# Altium schematic sheet 1.power.SchDoc: Power Schematic
size A; DrawnBy: Pramod Sandaruwan; DocumentNumber: 1; Revision: V3; SheetNumber: 1; SheetTotal: 6
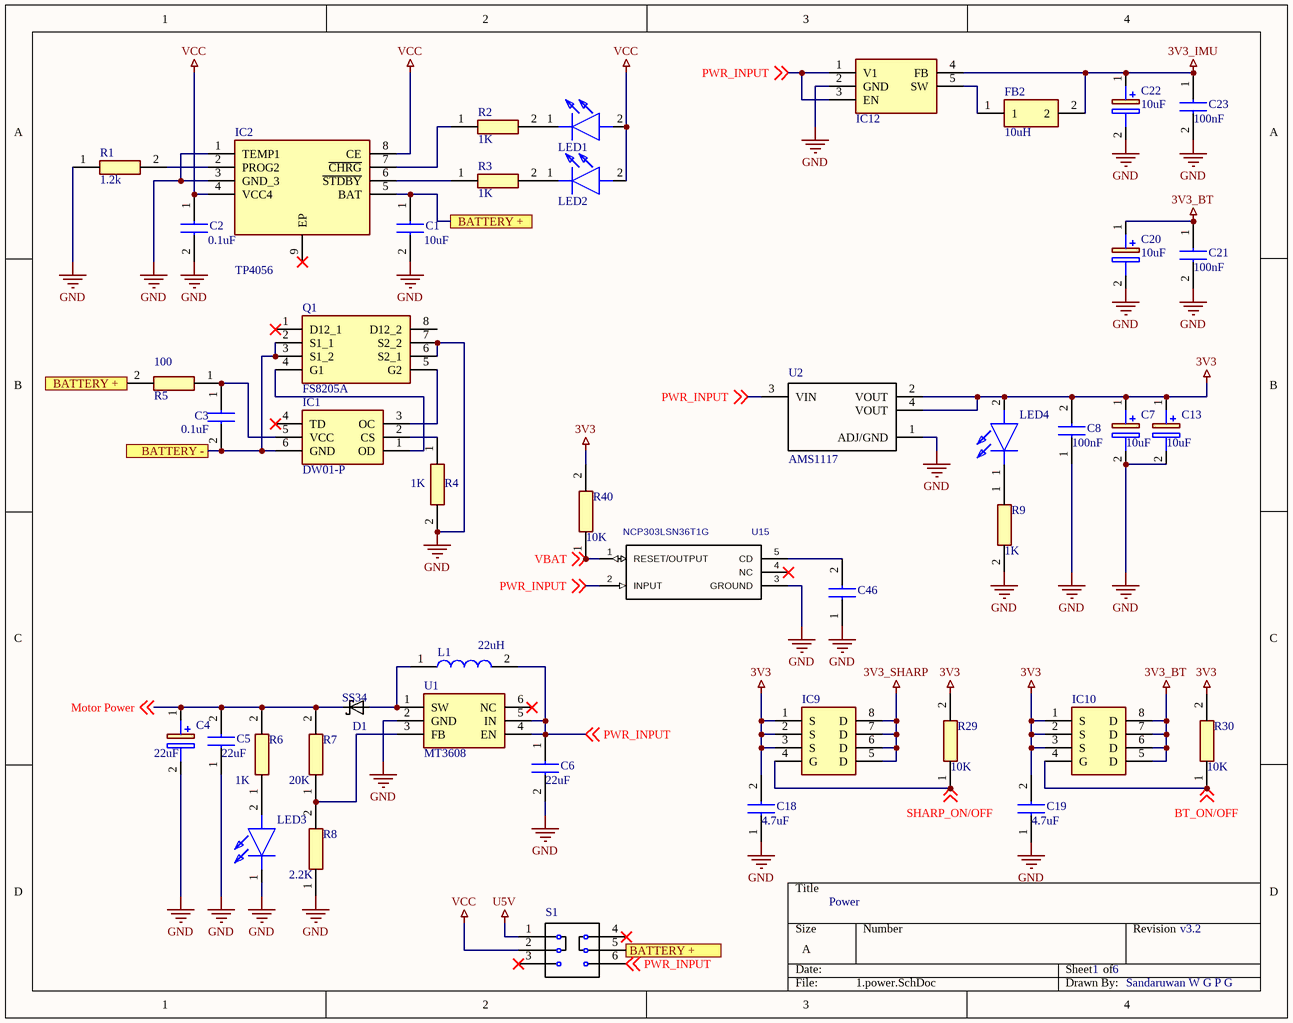
[diagram p0: 1.power.SchDoc]

## Parts
C1  value 10uF  [CAPC2012X94N]  (hidden comment: 08055A101JAT2A)
C2  value 0.1uF  [CAPC2012X94N]  (hidden comment: 08055A101JAT2A)
C3  value 0.1uF  [CAPC2012X94N]  (hidden comment: 08055A101JAT2A)
C4  value 22uF  [CAPAE830X1050N]  (hidden comment: UUD1E221MNL1GS)
C5  value 22uF  [CAPC2012X94N]  (hidden comment: 08055A101JAT2A)
C6  value 22uF  [CAPC2012X94N]  (hidden comment: 08055A101JAT2A)
C7  value 10uF  [CAPPM3216X180N]  (hidden comment: tantalum capacitor 1206)
C8  value 100nF  [CAPC2012X94N]  (hidden comment: 08055A101JAT2A)
C13  value 10uF  [CAPPM3216X180N]  (hidden comment: tantalum capacitor 1206)
C18  value 4.7uF  [CAPC2012X94N]  (hidden comment: 08055A101JAT2A)
C19  value 4.7uF  [CAPC2012X94N]  (hidden comment: 08055A101JAT2A)
C20  value 10uF  [CAPPM3216X180N]  (hidden comment: tantalum capacitor 1206)
C21  value 100nF  [CAPC2012X94N]  (hidden comment: 08055A101JAT2A)
C22  value 10uF  [CAPPM3216X180N]  (hidden comment: tantalum capacitor 1206)
C23  value 100nF  [CAPC2012X94N]  (hidden comment: 08055A101JAT2A)
C46  08055A101JAT2A  [CAPC2012X94N]  (value not drawn)
D1  SS34  [*SMA]
FB2  value 10uH  [BEADC1608X95N]  (hidden comment: inductor 0603)
IC1  DW01-P  [SOT95P280X135-6N]
IC2  TP4056  [SOIC127P600X175-9N]
IC9  SI4143DY-T1-GE3  [SI4143DY-T1-GE3]  (value not drawn)
IC10  SI4143DY-T1-GE3  [SI4143DY-T1-GE3]  (value not drawn)
IC12  TPS62203  [SOT95P280X145-5N]  (value not drawn)
L1  value 22uH  [INDPM8080X420N]  (hidden comment: 74404084220)
LED1  150080BS75000  [LEDC2012X80N]  (value not drawn)
LED2  150080BS75000  [LEDC2012X80N]  (value not drawn)
LED3  150080BS75000  [LEDC2012X80N]  (value not drawn)
LED4  150080BS75000  [LEDC2012X80N]  (value not drawn)
Q1  FS8205A  [SOP65P640X120-8N]
R1  value 1.2k  [RESC2012X65N]  (hidden comment: CPF0805B100KE)
R2  value 1K  [RESC2012X65N]  (hidden comment: CPF0805B100KE)
R3  value 1K  [RESC2012X65N]  (hidden comment: CPF0805B100KE)
R4  value 1K  [RESC2012X65N]  (hidden comment: CPF0805B100KE)
R5  value 100  [RESC2012X65N]  (hidden comment: CPF0805B100KE)
R6  value 1K  [RESC2012X65N]  (hidden comment: CPF0805B100KE)
R7  value 20K  [RESC2012X65N]  (hidden comment: CPF0805B100KE)
R8  value 2.2K  [RESC2012X65N]  (hidden comment: CPF0805B100KE)
R9  value 1K  [RESC2012X65N]  (hidden comment: CPF0805B100KE)
R29  value 10K  [RESC2012X65N]  (hidden comment: CPF0805)
R30  value 10K  [RESC2012X65N]  (hidden comment: CPF0805)
R40  value 10K  [RESC2012X65N]  (hidden comment: CPF0805)
S1  1-1437575-7  [*SW_1-1437575-7]  (value not drawn)
U1  MT3608  [SOT95P280X145-6N]
U2  AMS1117  [*SOT229P700X180-4N]
U15  NCP303LSN36T1G  [TSOP-5]

## Ports
BATTERY +, BATTERY -

## Nets
3V3: C7.1(+) C8.2 C13.1(+) C18.2 C19.2 IC9.1(S) IC9.2(S) IC9.3(S) IC10.1(S) IC10.2(S) IC10.3(S) LED4.2(A) R29.2 R30.2 R40.2 U2.2(VOUT) U2.4(VOUT)
3V3_BT: C20.1(+) C21.1 IC10.5(D) IC10.6(D) IC10.7(D) IC10.8(D)
3V3_IMU: C22.1(+) C23.1 FB2.2 IC12.4(FB)
3V3_SHARP: IC9.5(D) IC9.6(D) IC9.7(D) IC9.8(D)
GND: C1.2 C2.2 C4.2(-) C5.1 C6.2 C7.2(-) C8.1 C13.2(-) C18.1 C19.1 C20.2(-) C21.2 C22.2(-) C23.2 C46.1 IC2.1(TEMP1) IC2.3(GND_3) IC12.2(GND) LED3.1(K) Q1.6(S2_1) Q1.7(S2_2) R1.1 R4.2 R8.1 R9.2 U1.2(GND) U2.1(ADJ/GND) U15.3(GROUND)
U5V: S1.1
VCC: C2.1 IC2.4(VCC4) IC2.8(CE) LED1.2(A) LED2.2(A) S1.2
BATTERY +: C1.1 IC2.5(BAT) R5.2 S1.5 ; port BATTERY +
BATTERY -: C3.2 IC1.6(GND) Q1.2(S1_1) Q1.3(S1_2) ; port BATTERY -
BT_ON/OFF: IC10.4(G) R30.1 ; off-sheet BT_ON/OFF
Motor Power: C4.1(+) C5.2 D1.C R6.2 R7.2 ; off-sheet Motor Power
PWR_INPUT: C6.1 IC12.1(V1) IC12.3(EN) L1.2 S1.6 U1.4(EN) U1.5(IN) U2.3(VIN) U15.2(INPUT) ; off-sheet PWR_INPUT
SHARP_ON/OFF: IC9.4(G) R29.1 ; off-sheet SHARP_ON/OFF
VBAT: R40.1 U15.1(RESET/OUTPUT) ; off-sheet VBAT
NetC3_1: C3.1 IC1.5(VCC) R5.1
NetC46_2: C46.2 U15.5(CD)
NetD1_A: D1.A L1.1 U1.1(SW)
NetFB2_1: FB2.1 IC12.5(SW)
NetIC1_1: IC1.1(OD) Q1.4(G1)
NetIC1_2: IC1.2(CS) R4.1
NetIC1_3: IC1.3(OC) Q1.5(G2)
NetIC2_2: IC2.2(PROG2) R1.2
NetIC2_6: IC2.6(~{STDBY}) R3.1
NetIC2_7: IC2.7(~{CHRG}) R2.1
NetLED1_1: LED1.1(K) R2.2
NetLED2_1: LED2.1(K) R3.2
NetLED3_2: LED3.2(A) R6.1
NetLED4_1: LED4.1(K) R9.1
NetR7_1: R7.1 R8.2 U1.3(FB)

Not connected (* = marked no-connect by the designer): IC1 4(TD)*; IC2 9(EP)*; Q1 1(D12_1)* 8(D12_2); S1 3* 4*; U1 6(NC)*; U15 4(NC)*

## Notes on the sheet
- Power
- v3.2
- Sandaruwan W G P G

## Library data of the parts
C1-C3 C5 C6 C8 C18 C19 C21 C23 C46 = 08055A101JAT2A: Capacitor; Manufacturer_Name: AVX; Allied_Number: 70474488; Datasheet Link: https://componentsearchengine.com/Datasheets/1/06031A100FAT2A.pdf; Height: 0.94mm; Manufacturer_Part_Number: 08055A101JAT2A; Mouser Part Number: 581-08055A101J; Mouser Price/Stock: https://www.mouser.com/Search/Refine.aspx?Keyword=581-08055A101J; RS Part Number: 0391000P; RS Price/Stock: http://uk.rs-online.com/web/p/products/0391000P; Allied Price/Stock: https://www.alliedelec.com/avx-08055a101jat2a/70474488/
C4 = UUD1E221MNL1GS: Capacitor Polarised; Manufacturer_Name: Nichicon; Allied_Number: 70409814; Datasheet Link: https://www.mouser.com/datasheet/2/293/e-uud-1513238.pdf; Height: 10.5mm; Manufacturer_Part_Number: UUD1E221MNL1GS; Mouser1 Part Number: 647-UUD1E221MNL; Mouser1 Price/Stock: https://www.mouser.com/Search/Refine.aspx?Keyword=647-UUD1E221MNL; RS Part Number: 7393453P; RS Price/Stock: http://uk.rs-online.com/web/p/products/7393453P; Allied Price/Stock: https://www.alliedelec.com/nichicon-uud1e221mnl1gs/70409814/
C7 C13 C20 C22 = tantalum capacitor 1206: Capacitor Polarised
D1 = SS34_1: Diode Schottky 40V 3A 2-Pin SMC T/R; MF: ON Semiconductor; MP: SS34; SnapEDA_Link: https://www.snapeda.com/parts/SS34/ON%20Semiconductor/view-part/?ref=snap; Price: None; Package: DO-214AB-214 ON Semiconductor; Availability: Unavailable; Value: *
FB2 = inductor 0603: Ferrite Bead
IC1 = DW01-P: Integrated Circuit; Manufacturer_Name: Fortune Semiconductor Corporation; Datasheet Link: https://cdn.sparkfun.com/assets/learn_tutorials/2/5/1/DW01-P_DataSheet_V10.pdf; Height: 1.35mm; Manufacturer_Part_Number: DW01-P
IC2 = TP4056: Integrated Circuit; Manufacturer_Name: NanJing Top Power; Datasheet Link: https://dlnmh9ip6v2uc.cloudfront.net/datasheets/Prototyping/TP4056.pdf; Height: 1.75mm; Manufacturer_Part_Number: TP4056
IC9 IC10 = SI4143DY-T1-GE3: Integrated Circuit
IC12 = TPS62203: Integrated Circuit
L1 = 74404084220: Inductor; Manufacturer_Name: Wurth Elektronik; Datasheet Link: https://katalog.we-online.de/pbs/datasheet/74404084220.pdf; Height: 4.2mm; Manufacturer_Part_Number: 74404084220; Mouser Part Number: 710-74404084220; Mouser Price/Stock: https://www.mouser.com/Search/Refine.aspx?Keyword=710-74404084220; RS Part Number: 8164733P; RS Price/Stock: http://uk.rs-online.com/web/p/products/8164733P
LED1-LED4 = 150080BS75000: LED; Manufacturer_Name: Wurth Elektronik; Datasheet Link: https://katalog.we-online.com/led/datasheet/150080BS75000.pdf; Height: 0.8mm; Manufacturer_Part_Number: 150080BS75000; Mouser Part Number: 710-150080BS75000; Mouser Price/Stock: https://www.mouser.com/Search/Refine.aspx?Keyword=710-150080BS75000; RS Part Number: 8154228P; RS Price/Stock: http://uk.rs-online.com/web/p/products/8154228P
Q1 = FS8205A: Transistor; Manufacturer_Name: SII Semiconductor; Datasheet Link: http://www.ic-fortune.com/upload/Download/FS8205A-DS-12_EN.pdf; Height: 1.2mm; Manufacturer_Part_Number: FS8205A
R1-R9 = CPF0805B100KE: Resistor; Manufacturer_Name: TE Connectivity; Allied_Number: 70286772; Datasheet Link: http://docs-europe.electrocomponents.com/webdocs/13d1/0900766b813d116f.pdf; Height: 0.65mm; Manufacturer_Part_Number: CPF0805B100KE; Mouser Part Number: 279-CPF0805B100KE; Mouser Price/Stock: https://www.mouser.com/Search/Refine.aspx?Keyword=279-CPF0805B100KE; RS Part Number: 6662673; RS Price/Stock: https://uk.rs-online.com/web/p/products/6662673; Allied Price/Stock: https://www.alliedelec.com/te-connectivity-cpf0805b100ke/70286772/
R29 R30 R40 = CPF0805: Resistor; Manufacturer_Name: TE Connectivity; Manufacturer_Part_Number: CPF0805B100KE; Allied_Number: 70286772; Datasheet Link: http://docs-europe.electrocomponents.com/webdocs/13d1/0900766b813d116f.pdf; Height: 0.65mm; Mouser Part Number: 279-CPF0805B100KE; Mouser Price/Stock: https://www.mouser.com/Search/Refine.aspx?Keyword=279-CPF0805B100KE; RS Part Number: 6662673; RS Price/Stock: https://uk.rs-online.com/web/p/products/6662673; Allied Price/Stock: https://www.alliedelec.com/te-connectivity-cpf0805b100ke/70286772/
S1 = 1-1437575-7: Slide Switch ON ON DPDT Top Slide 0.4VA 20VAC 20VDC 10000Cycle PC Pins Through Hole; MF: TE Connectivity; Price: None; Package: None; MP: 1-1437575-7; SnapEDA_Link: https://www.snapeda.com/parts/1-1437575-7/TE%20Connectivity%20ALCOSWITCH%20Switches/view-part/?ref=snap; Availability: Unavailable; TE_purchase_URL: https://www.te.com/usa-en/product-1-1437575-7.html?te_bu=Cor&te_type=disp&te_campaign=seda_glo_cor-seda-global-disp-prtnr-fy19-seda-model-bom-cta_sma-317_1&elqCampaignId=32493; Value: *
U1 = MT3608: Undefined or Miscellaneous; Manufacturer_Name: Aerosemi; Datasheet Link: https://www.olimex.com/Products/Breadboarding/BB-PWR-3608/resources/MT3608.pdf; Height: 1.45mm; Manufacturer_Part_Number: MT3608
U2 = AMS1117: 1A LOW DROPOUT VOLTAGE REGULATOR; MF: Seeed Technology; MP: AMS1117; SnapEDA_Link: https://www.snapeda.com/parts/AMS1117/Seeed%20Technology%20Co.%2C%20Ltd/view-part/?ref=snap; Price: None; Package: SOT-223 Seeed Technology; Availability: Unavailable; Value: *
U15 = NCP303LSN36T1G: C: Copyright (C) 2016 Accelerated Designs. All rights reserved; Vendor: ON Semiconductor; Value: NCP303LSN36T1G; Manufacturer_Part_Number: NCP303LSN36T1G; Copyright: Copyright (C) 2016 Accelerated Designs. All rights reserved